# EAGLE design PowerControlExpansion (EAGLE 6.1)
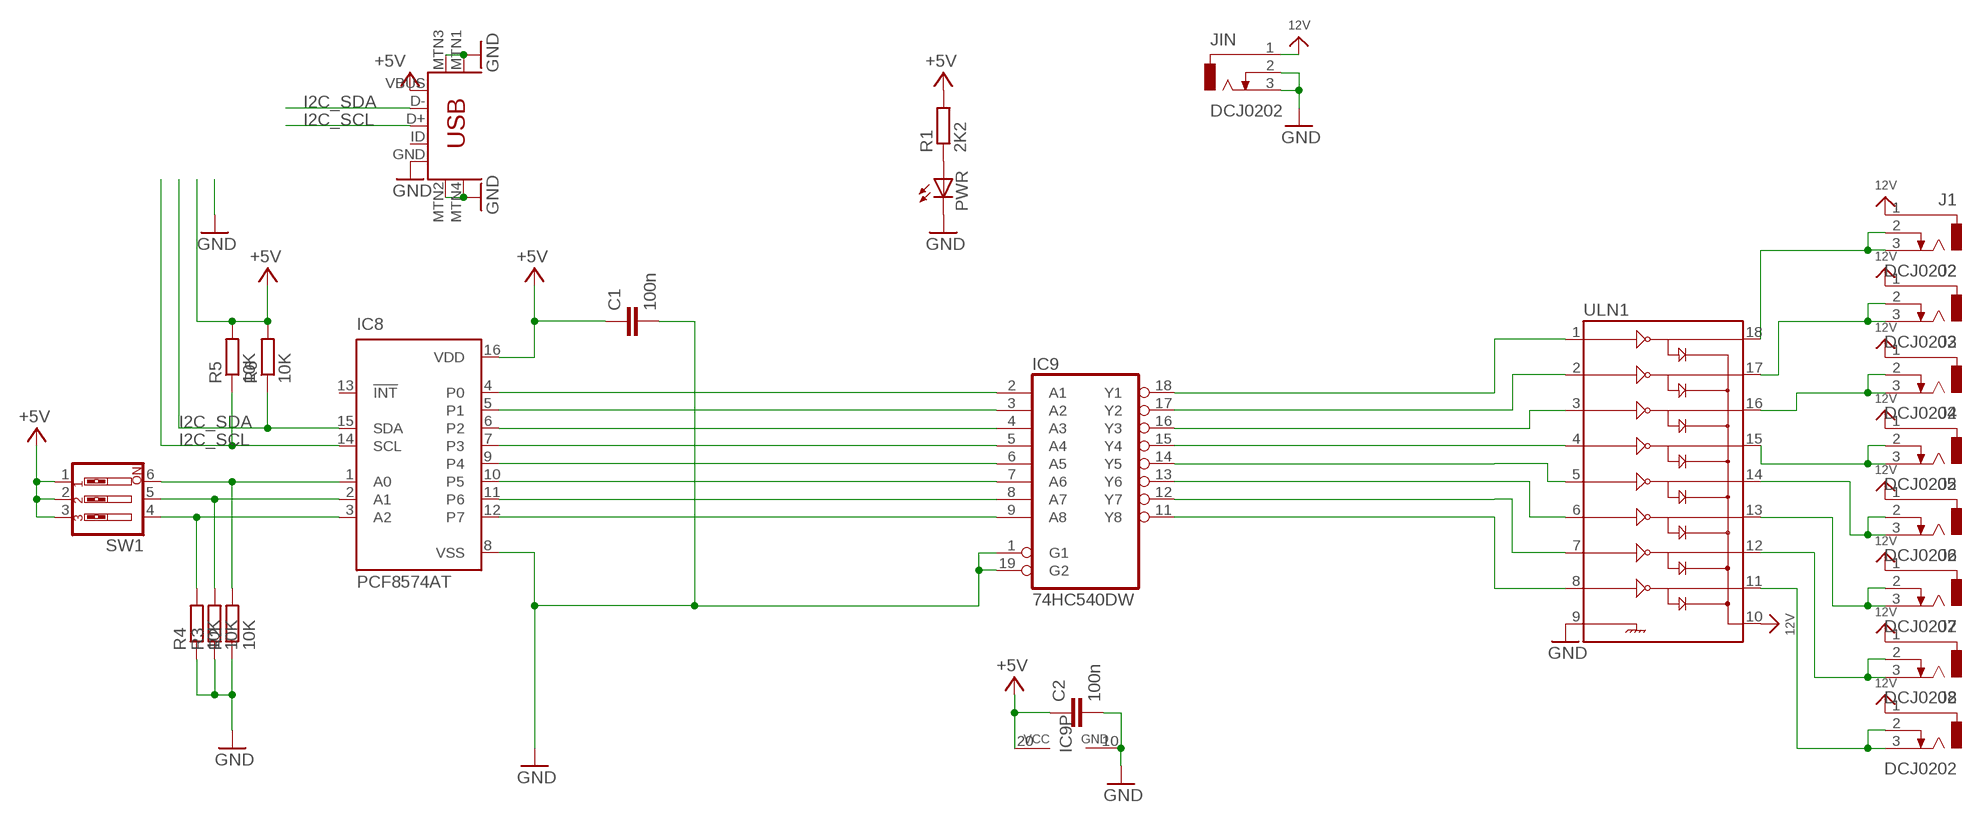
[diagram p0: schematic, sheet 1]

## Parts
C1  100n  C-EUC0805K  [C0805K]
C2  100n  C-EUC0805K  [C0805K]
IC8  PCF8574AT  PCF8574T  [SO16W]
IC9  74HC540DW  [SO20W]
J1  DCJ0202  [DCJ0202]
J2  DCJ0202  [DCJ0202]
J3  DCJ0202  [DCJ0202]
J4  DCJ0202  [DCJ0202]
J5  DCJ0202  [DCJ0202]
J6  DCJ0202  [DCJ0202]
J7  DCJ0202  [DCJ0202]
J8  DCJ0202  [DCJ0202]
JIN  DCJ0202  [DCJ0202]
PWR  LED3MM  [LED3MM]
R1  2K2  R-EU_R0805W  [R0805W]
R2  10K  R-EU_R0805W  [R0805W]
R3  10K  R-EU_R0805W  [R0805W]
R4  10K  R-EU_R0805W  [R0805W]
R5  10K  R-EU_R0805W  [R0805W]
R6  10K  R-EU_R0805W  [R0805W]
SW1  SW_DIP-3  [EDG-03]
U1  USB-MINIB-5PIN  [USB-MINIB]
ULN1  ULN2803SOICW  [SO18L]

## Nets
12V [12V]: J1.1 J2.1 J3.1 J4.1 J5.1 J6.1 J7.1 J8.1 JIN.1 ULN1.10
+5V: C1.1 C2.1 IC8.16(VDD) IC9.20(VCC) R1.2 R5.2 R6.2 SW1.1 SW1.2 SW1.3 U1.VBUS
GND [gnd]: C1.2 C2.2 IC8.8(VSS) IC9.1(G1) IC9.10(GND) IC9.19(G2) JIN.2 JIN.3 PWR.K(C) R2.1 R3.1 R4.1 U1.GND U1.MTN1(MTN2) U1.MTN2(MTN3) U1.MTN3(MTN1) U1.MTN4 ULN1.9
I2C_SCL: IC8.14(SCL) R5.1 U1.D+
I2C_SDA: IC8.15(SDA) R6.1 U1.D-
N$1 [power]: J1.2 J1.3 ULN1.18
N$2 [power]: J2.2 J2.3 ULN1.17
N$3 [power]: J3.2 J3.3 ULN1.16
N$6: PWR.A R1.1
N$7 [power]: J4.2 J4.3 ULN1.15
N$8: IC9.18(Y1) ULN1.1
N$9 [power]: J5.2 J5.3 ULN1.14
N$10 [power]: J6.2 J6.3 ULN1.13
N$11: IC8.2(A1) R3.2 SW1.5
N$12: IC8.3(A2) R4.2 SW1.4
N$13: IC8.1(A0) R2.2 SW1.6
N$17: IC9.17(Y2) ULN1.2
N$20 [power]: J7.2 J7.3 ULN1.12
N$21: IC9.16(Y3) ULN1.3
N$22 [power]: J8.2 J8.3 ULN1.11
N$23: IC9.15(Y4) ULN1.4
N$25: IC9.14(Y5) ULN1.5
N$26: IC9.13(Y6) ULN1.6
N$27: IC9.12(Y7) ULN1.7
N$28: IC9.11(Y8) ULN1.8
N$29: IC8.4(P0) IC9.2(A1)
N$30: IC8.5(P1) IC9.3(A2)
N$32: IC8.6(P2) IC9.4(A3)
N$33: IC8.7(P3) IC9.5(A4)
N$34: IC8.9(P4) IC9.6(A5)
N$35: IC8.10(P5) IC9.7(A6)
N$36: IC8.11(P6) IC9.8(A7)
N$39: IC8.12(P7) IC9.9(A8)
Unconnected: IC8.13(!INT) U1.ID

## Library data of the parts
C1 C2 = rcl:C-EU: CAPACITOR, European symbol
IC8 = micro-philips:PCF8574: I2C-Bus Remote 8-bit I/O expander http://www.semiconductors.philips.com/acrobat_download/datasheets/PCF8574_4.pdf
IC9 = 74xx-eu:74*540: Octal BUFFER and LINE DRIVER, 3-state
J1-J8 JIN = con-jack:DCJ0202: DC POWER JACK Source: DCJ0202.pdf; OC_FARNELL: unknown; OC_NEWARK: unknown
PWR = led:LED: LED OSRAM: - CHIPLED LG R971, LG N971, LY N971, LG Q971, LY Q971, LO R971, LY R971 LH N974, LH R974 LS Q976, LO Q976, LY Q976 LO Q996 - Hyper CHIPLED LW Q18S LB Q993, LB Q99A, LB R99A - SideLED LS A670, LO A670, LY A670, LG A670, LP A670 LB A673, LV A673, LT A673, LW A673 LH A674 LY A675 LS A676, LA A676, LO A676, LY A676, LW A676 LS A679, LY A679, LG A679 - Hyper Micro SIDELED® LS Y876, LA Y876, LO Y876, LY Y876 LT Y87S - SmartLED LW L88C, LW L88S LB L89C, LB L89S, LG L890 LS L89K, LO L89K, LY L89K LS L896, LA L896, LO L896, LY L896 - TOPLED LS T670, LO T670, LY T670, LG T670, LP T670 LSG T670, LSP T670, LSY T670, LOP T670, LYG T670 LG T671, LOG T671, LSG T671 LB T673, LV T673, LT T673, LW T673 LH T674 LS T676, LA T676, LO T676, LY T676, LB T676, LH T676, LSB T676, LW T676 LB T67C, LV T67C, LT T67C, LS T67K, LO T67K, LY T67K, LW E67C LS E67B, LA E67B, LO E67B, LY E67B, LB E67C, LV E67C, LT E67C LW T67C LS T679, LY T679, LG T679 LS T770, LO T770, LY T770, LG T770, LP T770 LB T773, LV T773, LT T773, LW T773 LH T774 LS E675, LA E675, LY E675, LS T675 LS T776, LA T776, LO T776, LY T776, LB T776 LHGB T686 LT T68C, LB T68C - Hyper Mini TOPLED® LB M676 - Mini TOPLED Santana® LG M470 LS M47K, LO M47K, LY M47K Source: http://www.osram.convergy.de LUXEON: - LUMILED® LXK2-PW12-R00, LXK2-PW12-S00, LXK2-PW14-U00, LXK2-PW14-V00 LXK2-PM12-R00, LXK2-PM12-S00, LXK2-PM14-U00 LXK2-PE12-Q00, LXK2-PE12-R00, LXK2-PE12-S00, LXK2-PE14-T00, LXK2-PE14-U00 LXK2-PB12-K00, LXK2-PB12-L00, LXK2-PB12-M00, LXK2-PB14-N00, LXK2-PB14-P00, LXK2-PB14-Q00 LXK2-PR12-L00, LXK2-PR12-M00, LXK2-PR14-Q00, LXK2-PR14-R00 LXK2-PD12-Q00, LXK2-PD12-R00, LXK2-PD12-S00 LXK2-PH12-R00, LXK2-PH12-S00 LXK2-PL12-P00, LXK2-PL12-Q00, LXK2-PL12-R00 Source: www.luxeon.com KINGBRIGHT: KA-3528ASYC Source: www.kingbright.com
R1-R6 = rcl:R-EU_: RESISTOR, European symbol
SW1 = special:SW_DIP-3: DIP SWITCH
U1 = SparkFun:USB-MINIB: Mini-USB "B" connector with 5th pin broken out. Created new symbol breaking out 5th "ID" pin in mini/micro USB connector spec. See: http://en.wikipedia.org/wiki/Mini_usb#Cables. Uses same footprint as 4-pin symbol. Also added pins to connect to mounting / shield pads if required (probably not generally needed as signals aren't shielded once they leave the connector).
ULN1 = SparkFun:ULN2803: Darlington Driver ULN2803 Darlington array. 500mA max per channel, 8-channel package. Spark Fun Electronics SKU : COM-00312

## Net classes
0 default: width 0.305 mm, drill 0.305 mm, clearance 0.254 mm
1 power: width 0.61 mm, drill 0.305 mm, clearance 0.254 mm
2 gnd: width 0.305 mm, drill 0.305 mm, clearance 0.254 mm
3 12V: width 1.016 mm, drill 0.305 mm, clearance 0.254 mm

## Board
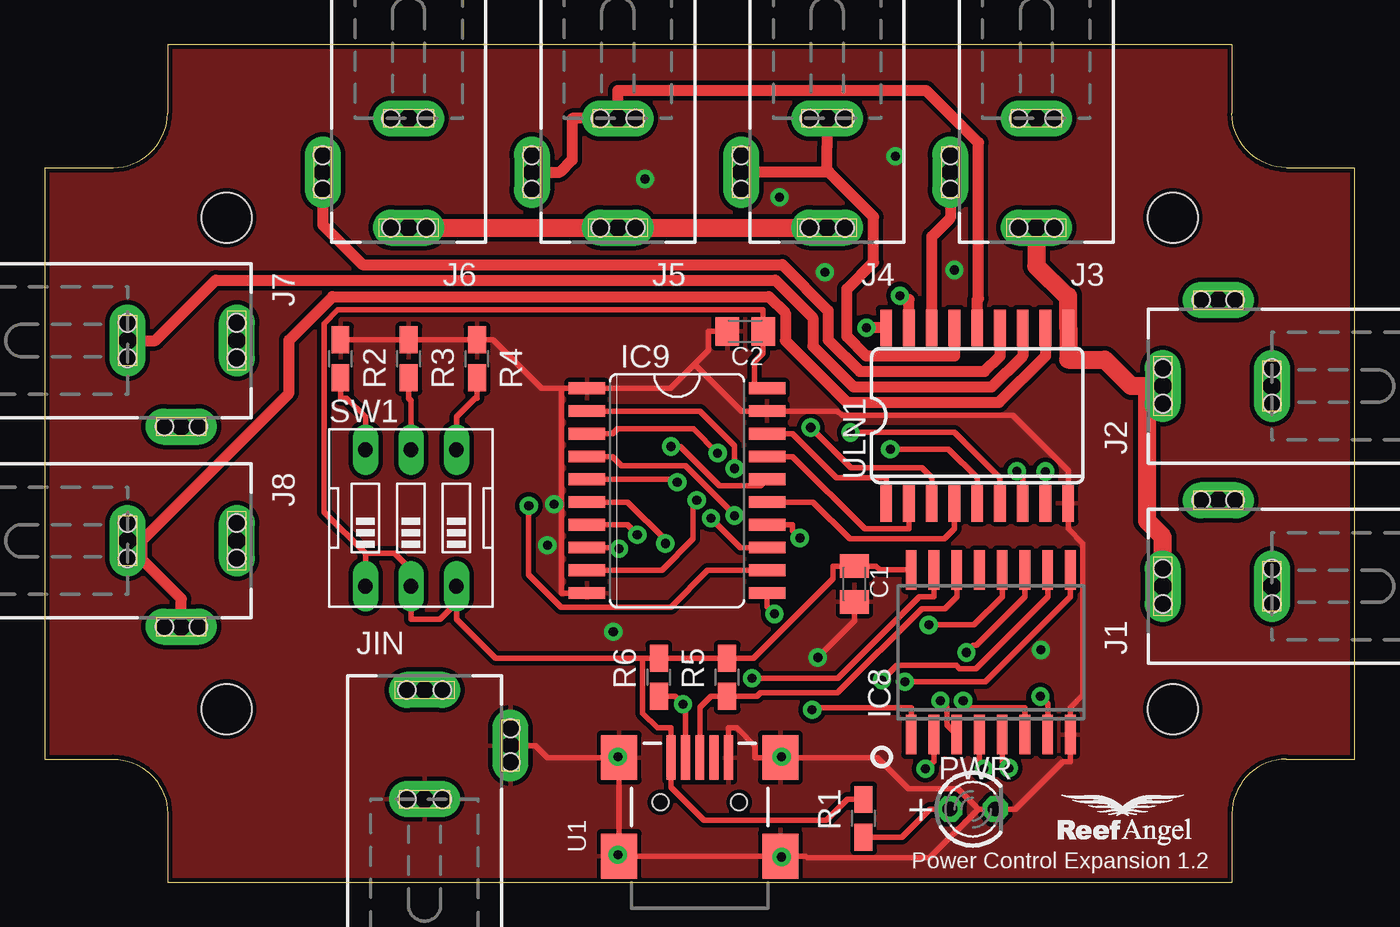
[diagram p1: board, top side]
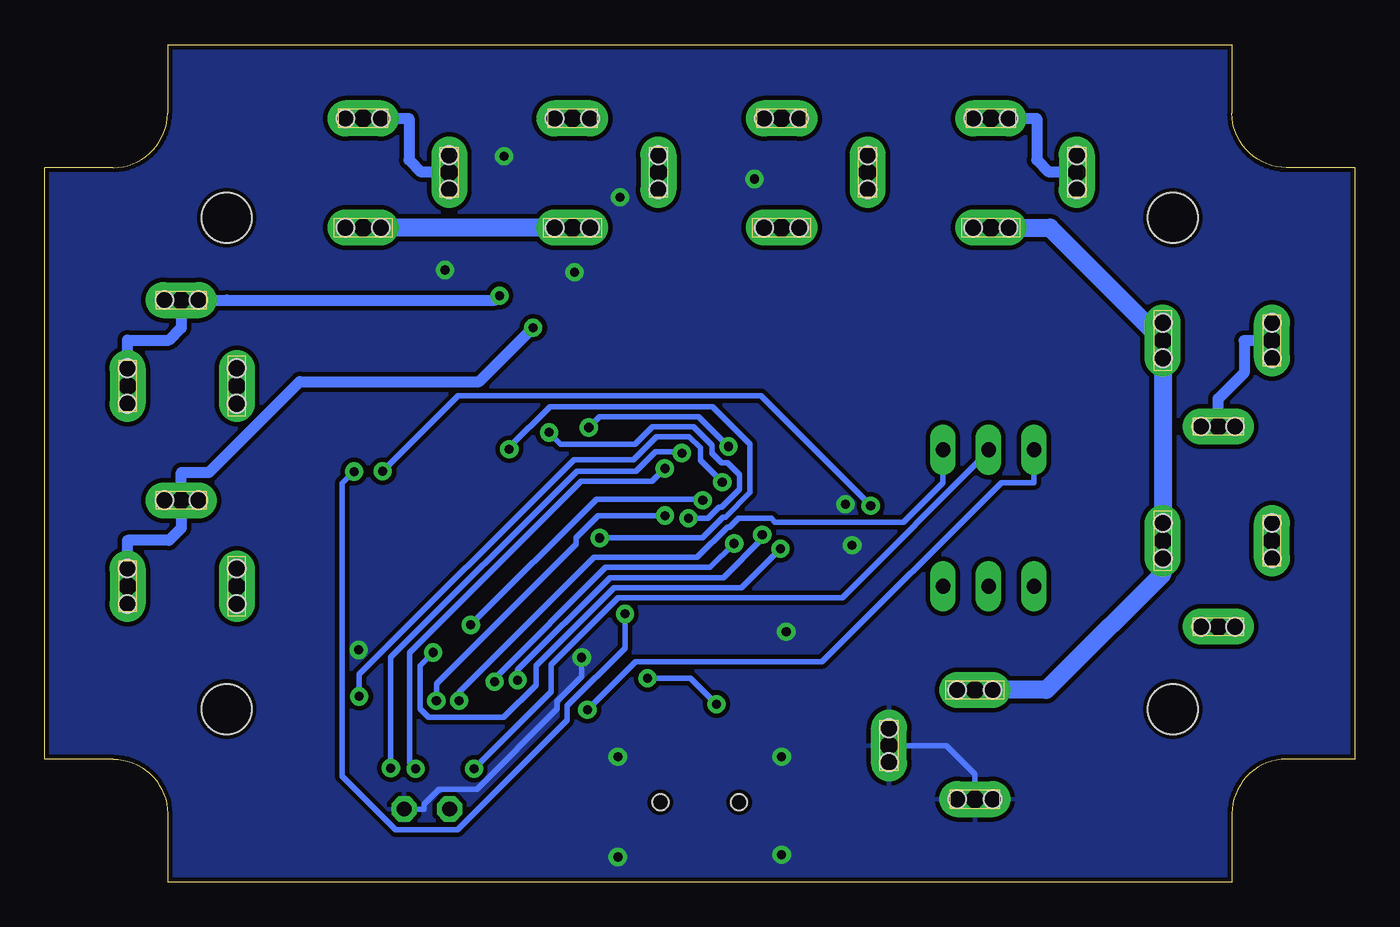
[diagram p2: board, bottom side, seen from below]

Size 73.15 x 46.74 mm. Coordinates in mm from the lower left corner, seen from the top.
Outline: 0,39.88 0,6.86 3.81,6.86 arc-90 6.86,3.81 6.86,0 66.29,0 66.29,3.81 arc-90 69.34,6.86 73.15,6.86 73.15,39.88 69.34,39.88 arc-90 66.29,42.93 66.29,46.74 6.86,46.74 6.86,42.93 arc-90 3.81,39.88 0,39.88
Copper layers (1*16): Top 0.035mm / dielectric 1.5mm / Bottom 0.035mm
Design rules: minimum track width 8mil, minimum drill 20mil, track to track 8mil, track to pad 8mil, pad to pad 8mil, via to via 8mil, smd to smd 8mil, copper to edge 10mil, drill to drill 8mil, minimum pad ring 12mil, minimum via ring 10mil, stop-mask expansion 4mil, vias tented up to drill 25mil, thermal gap 10mil
Holes 2.8 mm at 10.16,9.65 10.16,37.08 62.99,37.08 62.99,9.65

### Footprints (pad centres in the part's own frame; a part is rotated, then mirrored left to right if it is on the bottom)
C0805K = smd 1.3 x 1.6: 1 -1,0; 2 1,0
SO16W = smd 0.6 x 2.2: 1 -4.445,-4.6; 2 -3.175,-4.6; 3 -1.905,-4.6; 4 -0.635,-4.6; 5 0.635,-4.6; 6 1.905,-4.6; 7 3.175,-4.6; 8 4.445,-4.6; 9 4.445,4.6; 10 3.175,4.6; 11 1.905,4.6; 12 0.635,4.6; 13 -0.635,4.6; 14 -1.905,4.6; 15 -3.175,4.6; 16 -4.445,4.6
SO20W = smd 0.66 x 2.032: 1 -5.715,-5.029; 2 -4.445,-5.029; 3 -3.175,-5.029; 4 -1.905,-5.029; 5 -0.635,-5.029; 6 0.635,-5.029; 7 1.905,-5.029; 8 3.175,-5.029; 9 4.445,-5.029; 10 5.715,-5.029; 11 5.715,5.029; 12 4.445,5.029; 13 3.175,5.029; 14 1.905,5.029; 15 0.635,5.029; 16 -0.635,5.029; 17 -1.905,5.029; 18 -3.175,5.029; 19 -4.445,5.029; 20 -5.715,5.029
DCJ0202 = drill 1 pad 2 long: 1 0,3.1; 2 4.8,0; 3 0,-3 | hole 1: 0.991,-2.997; -0.991,-2.997; 4.801,-0.94; 4.801,0.965; 0.991,3.099; -0.991,3.099
LED3MM = drill 0.813 octagon: A -1.27,0; K 1.27,0
R0805W = smd 1.5 x 1: 1 -1.052,0; 2 1.052,0
EDG-03 = drill 0.813 long: 1 -2.54,-3.81; 2 0,-3.81; 3 2.54,-3.81; 4 2.54,3.81; 5 0,3.81; 6 -2.54,3.81
USB-MINIB = smd 2.5 x 0.5: D+ 2.5,0; D- 2.5,0.8; GND 2.5,-1.6; ID 2.5,-0.8; VBUS 2.5,1.6 | smd 2.5 x 2: MTN1 -3,4.5; MTN2 2.5,4.5; MTN3 -3,-4.5; MTN4 2.5,-4.5 | hole 0.9: 0,2.2; 0,-2.2
SO18L = smd 0.66 x 2.032: 1 -0.635,-4.902; 2 0.635,-4.902; 3 1.905,-4.902; 4 3.175,-4.902; 5 4.445,-4.902; 6 5.715,-4.902; 7 6.985,-4.902; 8 8.255,-4.902; 9 9.525,-4.902; 10 9.525,4.902; 11 8.255,4.902; 12 6.985,4.902; 13 5.715,4.902; 14 4.445,4.902; 15 3.175,4.902; 16 1.905,4.902; 17 0.635,4.902; 18 -0.635,4.902

### Placement (x,y rotation side)
C1  45.21,16.64 270 top
C2  39.12,30.73 180 top
IC8  52.83,12.83 0 top
IC9  35.31,21.84 270 top
J1  65.53,16.51 90 top
J2  65.53,27.69 90 top
J3  55.37,39.62 180 top
J4  43.69,39.62 180 top
J5  32,39.62 180 top
J6  20.32,39.62 180 top
J7  7.62,30.23 270 top
J8  7.62,19.05 270 top
JIN  21.21,7.62 0 top
PWR  51.82,4.06 0 top
R1  45.72,3.56 90 top
R2  16.51,29.21 270 top
R3  20.32,29.21 270 top
R4  24.13,29.21 270 top
R5  38.1,11.43 90 top
R6  34.29,11.43 90 top
SW1  20.45,20.32 0 top
U1  36.58,4.45 90 top
ULN1  47.62,26.04 0 top

### Tracks (layer width: path | path; a pad name or v marks a point on that pad's centre or on a via)
12V
  Top 1.016: J1.1 62.43,19.27 61.55,20.15 61.55,27.69 | 61.55,27.69 60.67,27.69 59.2,29.16 57.15,29.16 ULN1.10 57.15,32.72 57.04,32.72 55.37,34.38 J3.1 | J2.1 61.55,27.69 | J4.1 J5.1 J6.1
  Bottom 1.016: J4.1 J3.1 | JIN.1 17.22,10.72 16.51,11.43 10.72,17.22 J8.1 J7.1 17.02,36.52 J6.1
+5V
  Top 0.305: 22.99,15.6 22.07,14.68 20.45,14.68 SW1.2 20.45,17.42 19.53,18.34 17.91,18.34 | 22.99,15.6 22.99,14.68 25.19,12.48 33.38,12.48 | SW1.3 22.99,15.6 | 33.38,12.48 33.52,12.48 R6.2 35.2,12.48 R5.2 39.01,12.48 39.56,12.48 44.01,16.92 44.01,17.64 C1.1 45.81,17.64 46.42,17.64 46.63,17.43 IC8.16 | 33.38,12.48 33.38,9.42 34.2,8.6 34.98,8.6 U1.VBUS 34.98,5.29 36.82,3.44 43.65,3.44 44.81,4.61 R1.2 | 17.91,18.34 15.59,20.65 15.59,31.17 16.36,31.94 40.12,31.94 C2.1 40.12,30.27 40.12,29.53 39.62,29.04 39.62,27.56 IC9.20 | SW1.1 17.91,18.34
GND  (via drill 0.51 pad 1.02)
  Top 0.305: v43.17,12.53 45.21,14.58 C1.2 | 52.13,4.07 49.41,1.35 42.58,1.35 42.48,1.45 U1.MTN3 U1.MTN1 32.08,5.29 U1.MTN2 28.09,6.95 27.42,7.62 JIN.2 | 52.13,4.07 52.52,4.07 52.53,4.06 PWR.K 54.2,4.06 56.86,6.72 57.28,6.72 57.28,7.47 IC8.8 57.28,9.73 57.98,10.44 57.98,18.88 57.15,19.71 ULN1.9 57.15,22.55 57.15,22.96 54.05,26.06 44.51,26.06 44.28,26.29 41.76,26.29 IC9.19 38.91,26.29 36.29,28.91 | 52.13,4.07 50.99,5.21 48.23,5.21 46.5,6.95 U1.MTN4 39.67,6.95 39.67,7.57 38.64,8.6 38.18,8.6 U1.GND | R2.1 R3.1 R4.1 25.04,30.26 27.74,27.56 28.85,27.56 | 36.29,28.91 34.94,27.56 31.7,27.56 IC9.1 28.99,27.56 28.85,27.56 | 36.29,28.91 37.06,29.68 37.06,30.73 C2.2 | 28.85,27.56 28.85,16.13 IC9.10
  Bottom 0.305: v43.17,12.53 43.17,11.47 44.53,10.1 44.53,9.67 49.02,5.18 51.13,5.18 51.97,4.34 51.97,4.06 PWR.K | JIN.3 21.21,6.03 22.8,7.62 JIN.2
  other vias: 31.75,13.97 28.07,18.8 55.63,12.95 28.45,21.08 33.53,39.24 47.5,40.51 41.02,38.23 43.56,34.04 50.8,34.16 32,1.52 32,6.99 41.15,6.99 41.15,1.4
  pour Top (isolate 0.254): 0,0 0,46.99 73.66,46.99 73.66,0
  pour Bottom (isolate 0.254): 0,0 0,46.99 73.66,46.99 73.66,0
I2C_SCL
  Top 0.305: U1.D+ 36.58,9.76 37.19,10.38 R5.1 39.01,10.38 39.78,10.38 39.96,10.55 44.27,10.55 48.98,15.27 50.27,15.27 50.93,15.92 IC8.14
I2C_SDA  (via drill 0.51 pad 1.02)
  Top 0.305: v39.49,11.38 44.31,11.38 48.85,15.92 49.66,15.92 IC8.15 | U1.D- 35.78,9.8 v35.65,9.93 35.2,10.38 R6.1
  Bottom 0.305: v39.49,11.38 37.1,11.38 v35.65,9.93
N$1  (via drill 0.51 pad 1.02)
  Top 0.61: ULN1.18 v45.88,30.94
  Bottom 0.61: v45.88,30.94 48.89,27.93 58.91,27.93 63.97,22.87 65.53,22.87 J1.2 65.53,19.75 66.21,19.07 68.53,19.07 J1.3
N$2  (via drill 0.51 pad 1.02)
  Top 0.61: ULN1.17 48.26,32.51 47.97,32.51 v47.75,32.73
  Bottom 0.61: v47.75,32.73 48,32.49 62.97,32.49 J2.2 65.53,30.93 66.21,30.25 68.53,30.25 J2.3
N$3
  Top 0.61: J3.2 50.57,37.06 49.53,36.02 ULN1.16
  Bottom 0.61: J3.2 52.13,39.62 52.81,40.31 52.81,42.62 J3.3
N$6
  Top 0.305: PWR.A 49.43,4.06 47.87,2.5 R1.1
N$7
  Top 0.61: 43.69,39.62 J4.2 | 43.69,39.62 43.79,39.62 46.28,37.13 46.28,34.59 44.78,33.09 44.78,30.46 45.88,29.36 50.8,29.36 ULN1.15 | 43.69,39.62 43.69,41.06 J4.3
N$8
  Top 0.305: IC9.18 41.76,25.02 44.22,22.55 46.99,22.55 ULN1.1
N$9
  Top 0.61: ULN1.14 52.07,32.51 52.14,32.58 52.14,41.27 49.23,44.18 32,44.18 J5.3 29.45,42.62 29.45,40.31 28.76,39.62 J5.2
N$10
  Top 0.61: J6.2 15.52,36.68 17.74,34.46 41.19,34.46 43.75,31.9 43.75,30.27 45.52,28.5 52.48,28.5 53.34,29.36 ULN1.13
  Bottom 0.61: J6.2 17.08,39.62 17.76,40.31 17.76,42.62 J6.3
N$11  (via drill 0.51 pad 1.02)
  Top 0.305: IC8.2 49.66,6.72 49.58,6.72 v49.18,6.32 | R3.2 20.32,27 20.45,26.87 SW1.5
  Bottom 0.305: v49.18,6.32 44.88,10.62 44.88,12.13 41.13,15.88 28.62,15.88 20.45,24.05 SW1.5
N$12  (via drill 0.51 pad 1.02)
  Top 0.305: v50.01,10.12 50.37,9.76 50.37,8.78 IC8.3 | R4.2 24.13,27 24.03,27 22.99,25.96 SW1.4
  Bottom 0.305: v50.01,10.12 50.01,10.59 42.49,18.12 36.73,18.12 35.03,19.81 34.91,19.81 34.42,20.3 32.58,20.3 32.37,20.08 25.2,20.08 22.99,22.3 SW1.4
N$13  (via drill 0.51 pad 1.02)
  Top 0.305: v42.85,9.61 42.97,9.73 48.39,9.73 IC8.1 | R2.2 16.51,27 16.86,27 17.91,25.96 SW1.6
  Bottom 0.305: v42.85,9.61 40.17,12.29 29.74,12.29 19.74,22.3 17.91,22.3 SW1.6
N$17
  Top 0.305: IC9.17 41.76,23.75 45.8,19.71 48.26,19.71 ULN1.2
N$20
  Top 0.61: J7.3 6.18,30.23 9.55,33.6 40.8,33.6 42.88,31.51 42.88,29.91 45.16,27.64 52.88,27.64 54.61,29.36 ULN1.12
  Bottom 0.61: J7.2 7.62,26.98 6.18,28.43 6.18,30.23 J7.3
N$21  (via drill 0.51 pad 1.02)
  Top 0.305: ULN1.3 49.53,22.55 48.97,23.11 45.03,23.11 v42.77,25.37 | v34.98,24.31 35.49,24.31 37.68,22.12 39.98,22.12 IC9.16
  Bottom 0.305: v34.98,24.31 36.65,25.98 42.16,25.98 v42.77,25.37
N$22
  Top 0.61: 5.4,19.05 13.64,27.29 13.64,30.26 16.07,32.68 40.44,32.68 41.35,31.77 41.35,30.22 44.8,26.77 53.29,26.77 55.88,29.36 ULN1.11 | 5.4,19.05 5.4,18.03 7.62,15.81 J8.2 | J8.3 5.4,19.05
N$23
  Top 0.305: ULN1.4 50.8,19.71 50.24,19.15 44.97,19.15 42.91,21.21 IC9.15
N$25  (via drill 0.51 pad 1.02)
  Top 0.305: IC9.14 41.76,19.94 41.76,19.61 v42.16,19.2 | ULN1.5 52.07,22.55 50.47,24.16 v47.21,24.16
  Bottom 0.305: v47.21,24.16 47.21,24.27 44.94,26.54 35.87,26.54 33.77,24.44 33.77,21.74 35.14,20.37 35.26,20.37 36.43,19.2 v42.16,19.2
N$26  (via drill 0.51 pad 1.02)
  Top 0.305: v37.21,20.31 38.85,18.67 38.91,18.67 IC9.13 | v45,25.1 50.8,25.1 53.34,22.55 ULN1.6
  Bottom 0.305: v37.21,20.31 36.11,20.31 35.5,20.93 35.37,20.93 34.36,21.94 34.36,22.74 35.02,23.4 35.35,23.4 35.89,23.93 35.89,24.38 36.93,25.42 39.22,25.42 40.2,24.44 44.34,24.44 v45,25.1
N$27  (via drill 0.51 pad 1.02)
  Top 0.305: ULN1.7 54.61,22.6 v54.28,22.93 | v27.03,21.01 27.03,17.16 28.84,15.35 34.96,15.35 37.01,17.4 IC9.12
  Bottom 0.305: v54.28,22.93 50.07,27.14 33.17,27.14 v27.03,21.01
N$28  (via drill 0.51 pad 1.02)
  Top 0.305: ULN1.8 v55.88,22.91 | v40.75,14.97 40.34,15.38 IC9.11
  Bottom 0.305: v55.88,22.91 56.55,22.25 56.55,5.9 53.57,2.92 50.09,2.92 43.97,9.04 43.97,9.83 40.75,13.05 v40.75,14.97
N$29  (via drill 0.51 pad 1.02)
  Top 0.305: v38.52,23.08 38.52,24.35 36.59,26.29 31.7,26.29 IC9.2 | IC8.4 52.2,6.58 v52.45,6.33
  Bottom 0.305: v38.52,23.08 39.24,22.37 43.21,22.37 52.77,12.8 52.77,6.65 v52.45,6.33
N$30  (via drill 0.51 pad 1.02)
  Top 0.305: v37.58,23.95 36.23,25.29 31.97,25.29 31.7,25.02 IC9.3 | v53.83,6.36 53.47,6.72 IC8.5
  Bottom 0.305: v37.58,23.95 37.64,24.01 39.05,24.01 40.13,22.93 43.44,22.93 53.83,12.54 v53.83,6.36
N$32  (via drill 0.51 pad 1.02)
  Top 0.305: v38.51,20.45 38.51,20.5 35.77,23.24 32.21,23.24 31.7,23.75 IC9.4 | v51.28,10.12 51.67,9.73 54.74,9.73 IC8.6
  Bottom 0.305: v51.28,10.12 51.28,11.05 43.48,18.86 43.48,19.22 42.25,20.45 v38.51,20.45
N$33  (via drill 0.51 pad 1.02)
  Top 0.305: v35.32,22.32 35.16,22.48 31.7,22.48 IC9.5 | IC8.7 56.01,9.94 v55.59,10.36
  Bottom 0.305: v55.59,10.36 55.59,11.59 43.6,23.58 40.27,23.58 38.99,24.86 37.16,24.86 36.55,24.24 36.55,23.55 v35.32,22.32
N$34  (via drill 0.51 pad 1.02)
  Top 0.305: IC9.6 32.55,21.21 34.65,19.11 v34.65,18.89 | IC8.9 57.28,15.92 52.53,11.18 v48.03,11.18
  Bottom 0.305: v48.03,11.18 48.03,11.35 41.83,17.56 35.99,17.56 v34.65,18.89
N$35  (via drill 0.51 pad 1.02)
  Top 0.305: v46.76,11.27 47.57,12.09 50.9,12.09 51.09,11.9 51.98,11.9 56.01,15.92 IC8.10 | IC9.7 32.53,19.94 v33.09,19.38
  Bottom 0.305: v46.76,11.27 46.76,11.84 41.6,17 35.25,17 33.09,19.16 v33.09,19.38
N$36  (via drill 0.51 pad 1.02)
  Top 0.305: 51.86,13.21 52.02,13.21 54.74,15.92 IC8.11 | 51.86,13.21 | 51.86,13.21 v51.47,12.81 | IC9.8 32.01,18.67 v32.07,18.6
  Bottom 0.305: v51.47,12.81 52.2,12.08 52.2,9.68 51.71,9.19 47.52,9.19 45.72,10.99 45.72,12.08 41.36,16.44 34.23,16.44 v32.07,18.6
N$39  (via drill 0.51 pad 1.02)
  Top 0.305: IC9.9 34.46,17.4 36.21,19.15 36.21,21.1 v36.41,21.31 | IC8.12 53.47,15.92 51.9,14.35 v49.36,14.35
  Bottom 0.305: v49.36,14.35 42.34,21.37 36.48,21.37 v36.41,21.31

### Text on the board
tPlace: Power Control Expansion 1.2
tNames: +